# EAGLE design VSSOP-8 (EAGLE 8.0.2)
CNAME: VSSOP-8 Breakout; CREVISION: V1.0; DESIGNER: November Five
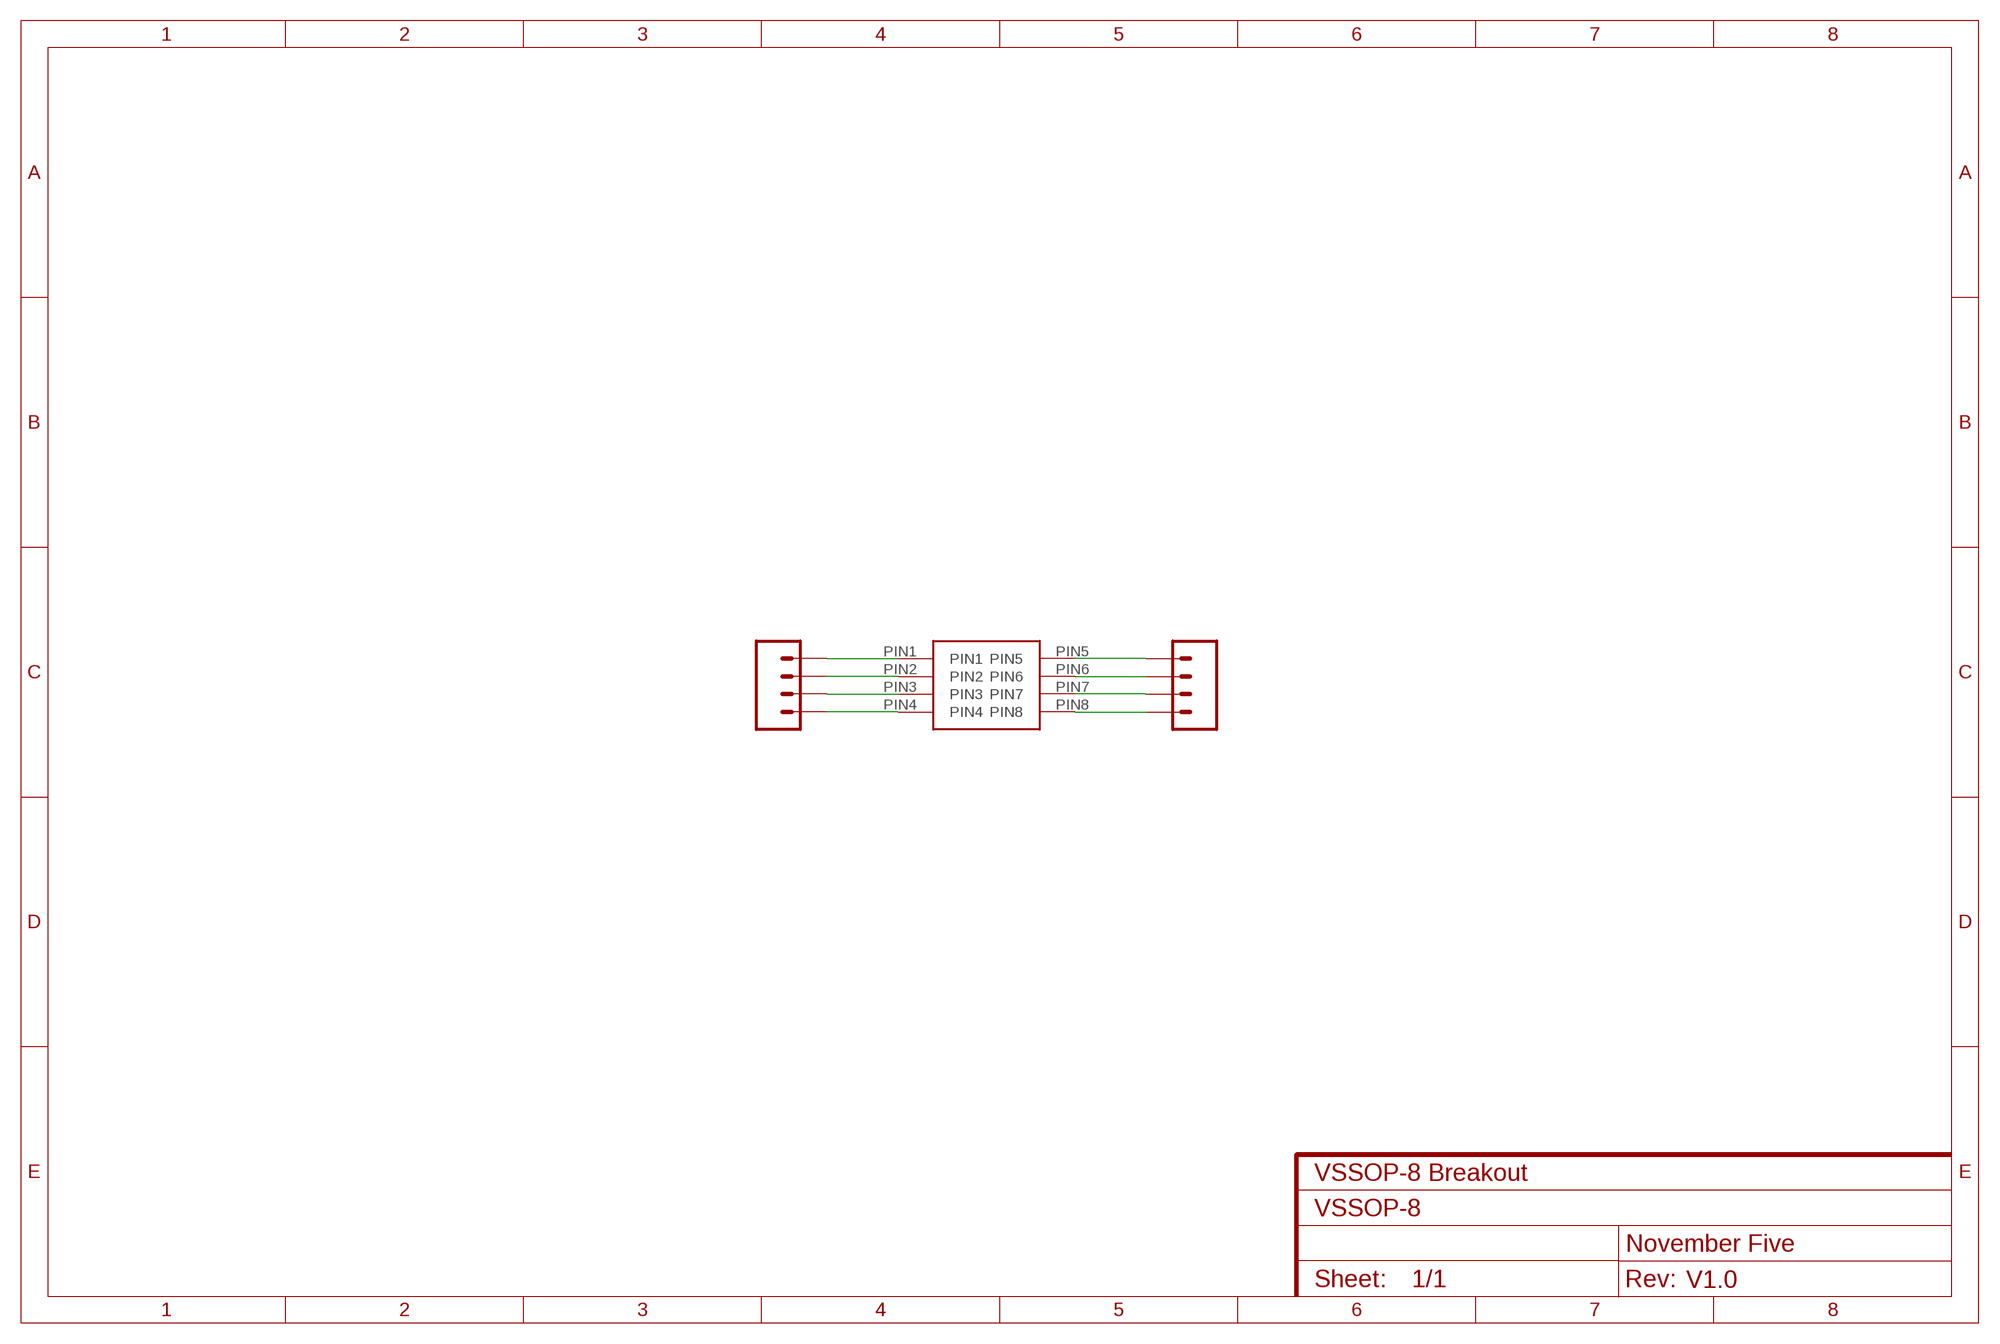
[diagram p0: schematic, sheet 1]

## Parts
J1  CONN_04  [1X04]
J2  CONN_04  [1X04]
U$1  VSSOP-8  [VSSOP-8]

## Nets
N$1: J1.4 U$1.PIN1
N$2: J1.3 U$1.PIN2
N$3: J1.2 U$1.PIN3
N$4: J1.1 U$1.PIN4
N$5: J2.1 U$1.PIN5
N$6: J2.2 U$1.PIN6
N$7: J2.3 U$1.PIN7
N$8: J2.4 U$1.PIN8

## Library data of the parts
J1 J2 = SparkFun-Connectors:CONN_04: Multi connection point. Often used as Generic Header-pin footprint for 0.1 inch spaced/style header connections On any of the 0.1 inch spaced packages, you can populate with these: Break Away Headers - Straight <https://www.sparkfun.com/products/116> (PRT-00116) Break Away Male Headers - Right Angle <https://www.sparkfun.com/products/553> (PRT-00553) Female Headers <https://www.sparkfun.com/products/115> (PRT-00115) Break Away Headers - Machine Pin <https://www.sparkfun.com/products/117> (PRT-00117) Break Away Female Headers - Swiss Machine Pin <https://www.sparkfun.com/products/743> (PRT-00743) For SCREWTERMINALS and SPRING TERMINALS visit here: Screw Terimnals on SparkFun.com <https://www.sparkfun.com/search/results?term=Screw+Terminals> (5mm/3.5mm/2.54mm spacing) This device is also useful as a general connection point to wire up your design to another part of your project. Our various solder wires solder well into these plated through hole pads. Hook-Up Wire - Assortment (Stranded, 22 AWG) <https://www.sparkfun.com/products/11375> (PRT-11375) Hook-Up Wire - Assortment (Solid Core, 22 AWG) <https://www.sparkfun.com/products/11367> (PRT-11367) View the entire wire category on our website here <https://www.sparkfun.com/categories/141> Special notes: Molex polarized connector foot print use with SKU : PRT-08231 with associated crimp pins and housings. 1MM SMD Version SKU: PRT-10208; PROD_ID: CONN-09696
U$1 = smd-footprints:VSSOP-8

## Board
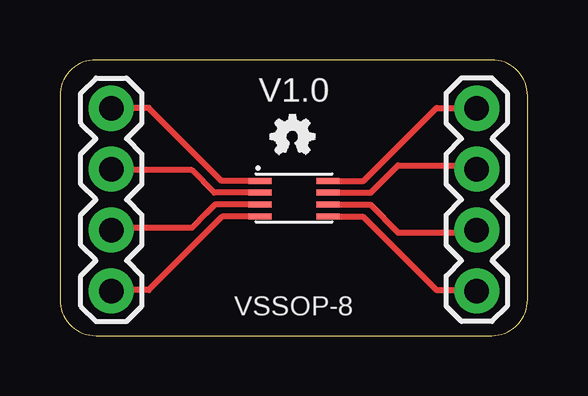
[diagram p1: board, top side]
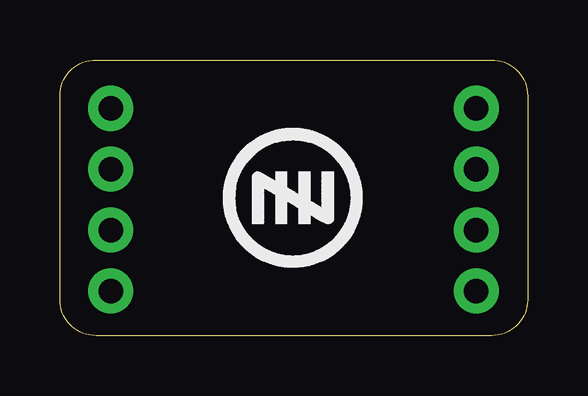
[diagram p2: board, bottom side, seen from below]

Size 19.5 x 11.5 mm. Coordinates in mm from the lower left corner, seen from the top.
Outline: 1.5,11.5 arc90 0,10 0,1.5 arc90 1.5,0 18,0 arc90 19.5,1.5 19.5,10 arc90 18,11.5 1.5,11.5
Copper layers (1*16): Top 0.035mm / dielectric 1.5mm / Bottom 0.035mm
Design rules "default": minimum track width 10mil, minimum drill 24mil, track to track 8mil, track to pad 8mil, pad to pad 8mil, via to via 8mil, smd to smd 8mil, copper to edge 40mil, drill to drill 8mil, minimum pad ring 10mil, minimum via ring 8mil, stop-mask expansion 4mil, vias tented up to drill 0mil, thermal gap 10mil

### Footprints (pad centres in the part's own frame; a part is rotated, then mirrored left to right if it is on the bottom)
1X04 = drill 1.016 pad 1.88: 1 0,0; 2 2.54,0; 3 5.08,0; 4 7.62,0
VSSOP-8 = smd 0.95 x 0.25: PIN1 -1.418,0.317; PIN2 -1.418,-0.177; PIN3 -1.418,-0.681; PIN4 -1.418,-1.175; PIN5 1.412,0.317; PIN6 1.412,-0.177; PIN7 1.412,-0.681; PIN8 1.412,-1.175

### Placement (x,y rotation side)
J1  2.14,1.86 90 top
J2  17.38,9.48 270 top
U$1  9.76,6.14 0 top
U$2  [LOGO-OSHWA]  8.5,7.5 0 top
U$3  [LOGO-NOVEMERFIVE-7SCALE]  11.75,2.85 0 top

### Tracks (layer width: path | path; a pad name or v marks a point on that pad's centre or on a via)
N$1
  Top 0.254: U$1.PIN1 6.74,6.46 3.7,9.5 2.16,9.5 J1.4
N$2
  Top 0.254: U$1.PIN2 6.44,5.96 5.5,6.9 2.18,6.9 J1.3
N$3
  Top 0.254: U$1.PIN3 6.46,5.46 6.1,5.1 5.5,4.5 2.24,4.5 J1.2
N$4
  Top 0.254: U$1.PIN4 6.77,4.97 3.7,1.9 2.18,1.9 J1.1
N$5
  Top 0.254: U$1.PIN5 12.66,6.46 15.7,9.5 17.36,9.5 J2.1
N$6
  Top 0.254: U$1.PIN6 12.96,5.96 14.1,7.1 17.22,7.1 J2.2
N$7
  Top 0.254: U$1.PIN7 12.94,5.46 14.1,4.3 17.28,4.3 J2.3
N$8
  Top 0.254: U$1.PIN8 12.63,4.97 15.7,1.9 17.34,1.9 J2.4

### Text on the board
tPlace: V1.0 | VSSOP-8